# EAGLE design CONTROL (EAGLE 6.4)
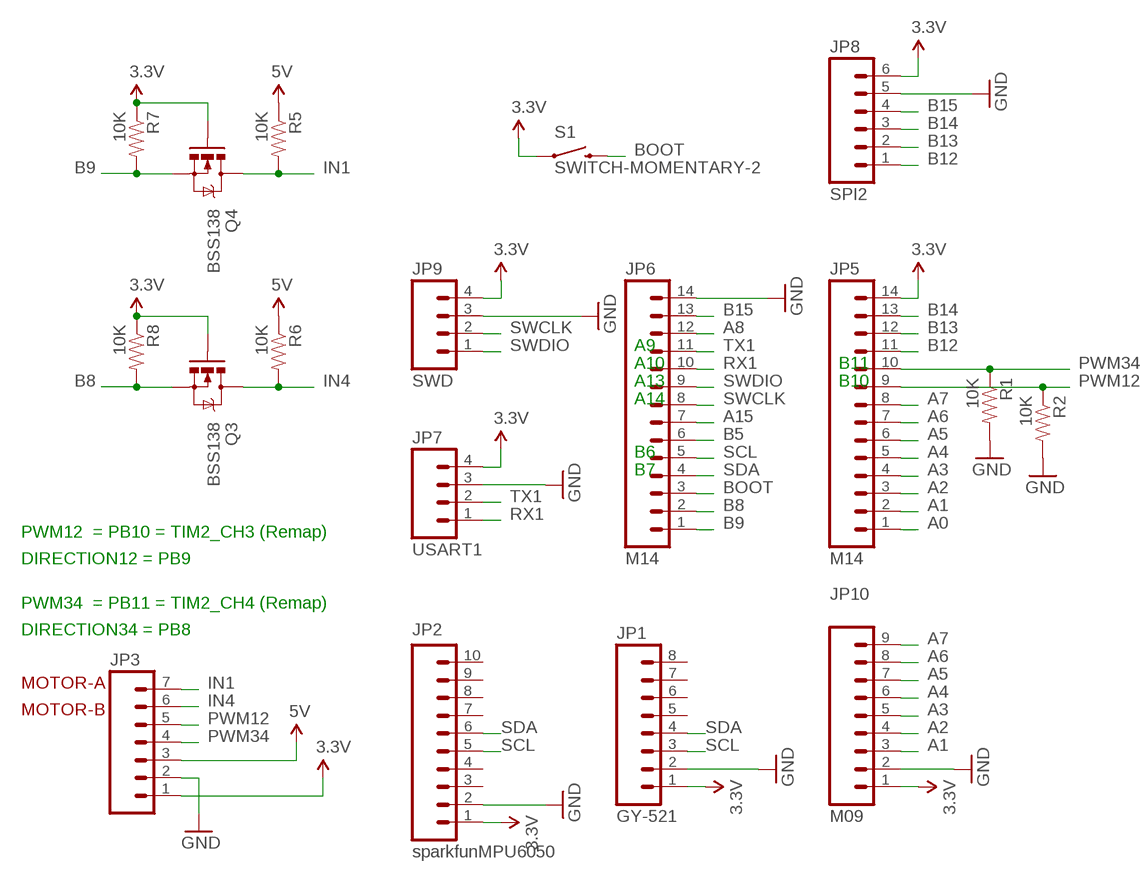
[diagram p0: schematic, sheet 1]

## Parts
JP1  GY-521  M081X08  [1X08]
JP2  sparkfunMPU6050  M10"  [1X10]
JP3  M07LONGPADS  [1X07_LONGPADS]
JP5  M14  [1X14]
JP6  M14  [1X14]
JP7  USART1  M04PTH  [1X04]
JP8  SPI2  M06SIP  [1X06]
JP9  SWD  M04PTH  [1X04]
JP10  M09  [1X09]
Q3  BSS138  MOSFET-NCHANNELSMD  [SOT23-3]
Q4  BSS138  MOSFET-NCHANNELSMD  [SOT23-3]
R1  10K  RESISTOR0805-RES  [0805]
R2  10K  RESISTOR0805-RES  [0805]
R5  10K  RESISTOR0805-RES  [0805]
R6  10K  RESISTOR0805-RES  [0805]
R7  10K  RESISTOR0805-RES  [0805]
R8  10K  RESISTOR0805-RES  [0805]
S1  SWITCH-MOMENTARY-2  [TACTILE_SWITCH_TALL]

## Nets
3.3V: JP1.1 JP2.1 JP3.1 JP5.14 JP7.4 JP8.6 JP9.4 JP10.1 Q3.1(G) Q4.1(G) R7.1 R8.1 S1.A2
5V: JP3.3 R5.1 R6.1
A0: JP5.1
A1: JP5.2 JP10.3
A2: JP5.3 JP10.4
A3: JP5.4 JP10.5
A4: JP5.5 JP10.6
A5: JP5.6 JP10.7
A6: JP5.7 JP10.8
A7: JP5.8 JP10.9
A8: JP6.12
A15: JP6.7
B5: JP6.6
B8: JP6.2 Q3.2(S) R8.2
B9: JP6.1 Q4.2(S) R7.2
B12: JP5.11 JP8.1
B13: JP5.12 JP8.2
B14: JP5.13 JP8.3
B15: JP6.13 JP8.4
BOOT: JP6.3 S1.B2
GND: JP1.2 JP2.2 JP3.2 JP6.14 JP7.3 JP8.5 JP9.3 JP10.2 R1.2 R2.2
IN1: JP3.7 Q4.3(D) R5.2
IN4: JP3.6 Q3.3(D) R6.2
PWM12: JP3.5 JP5.9 R2.1
PWM34: JP3.4 JP5.10 R1.1
RX1: JP6.10 JP7.1
SCL: JP1.3 JP2.5 JP6.5
SDA: JP1.4 JP2.6 JP6.4
SWCLK: JP6.8 JP9.2
SWDIO: JP6.9 JP9.1
TX1: JP6.11 JP7.2
Unconnected: JP1.5 JP1.6 JP1.7 JP1.8 JP2.3 JP2.4 JP2.7 JP2.8 JP2.9 JP2.10

## Notes on the sheet
- A9
- A10 | B11
- A13 | B10
- A14
- B6
- B7
- PWM12  = PB10 = TIM2_CH3 (Remap)
- DIRECTION12 = PB9
- PWM34  = PB11 = TIM2_CH4 (Remap)
- DIRECTION34 = PB8
- MOTOR-A
- MOTOR-B

## Library data of the parts
JP1 = SparkFun-Connectors:M08: Header 8 Standard 8-pin 0.1" header. Use with straight break away headers (SKU : PRT-00116), right angle break away headers (PRT-00553), swiss pins (PRT-00743), machine pins (PRT-00117), and female headers (PRT-00115).
JP2 = SparkFun-Connectors:M10: Header 10 Standard 10-pin 0.1" header. Use with straight break away headers (SKU : PRT-00116), right angle break away headers (PRT-00553), swiss pins (PRT-00743), machine pins (PRT-00117), and female headers (PRT-00115).
JP3 = SparkFun-Connectors:M07: Header 7 Standard 7-pin 0.1" header. Use with straight break away headers (SKU : PRT-00116), right angle break away headers (PRT-00553), swiss pins (PRT-00743), machine pins (PRT-00117), and female headers (PRT-00115). NOTES ON THE VARIANTS LOCK and LOCK_LONGPADS... This footprint was designed to help hold the alignment of a through-hole component (i.e. 7-pin header) while soldering it into place. You may notice that each hole has been shifted either up or down by 0.005 of an inch from it's more standard position (which is usually a perfectly straight line). This slight alteration caused the pins (the squares in the middle) to touch the edges of the holes. Because they are alternating, it causes a "brace" to hold the header in place. 0.005 has proven to be the perfect amount of "off-center" position when using our standard breakaway headers. Although looks a little odd when you look at the bare footprint, once you have a header in there, the alteration is very hard to notice. Also, if you push a header all the way into place, it is covered up entirely on the bottom side. This idea of altering the position of holes to aid alignment will be further integrated into the Sparkfun Library for other footprints. It can help hold any component with 3 or more connection pins.
JP5 JP6 = SparkFun-Connectors:M14: Header 14 Standard 14-pin 0.1" header. Use with straight break away headers (SKU : PRT-00116), right angle break away headers (PRT-00553), swiss pins (PRT-00743), machine pins (PRT-00117), and female headers (PRT-00115).
JP7 JP9 = SparkFun-Connectors:M04: Header 4 Standard 4-pin 0.1" header. Use with straight break away headers (SKU : PRT-00116), right angle break away headers (PRT-00553), swiss pins (PRT-00743), machine pins (PRT-00117), and female headers (PRT-00115). Molex polarized connector foot print use with SKU : PRT-08231 with associated crimp pins and housings. 1MM SMD Version SKU: PRT-10208
JP8 = SparkFun-Connectors:M06: Header 6 Standard 6-pin 0.1" header. Use with straight break away headers (SKU : PRT-00116), right angle break away headers (PRT-00553), swiss pins (PRT-00743), machine pins (PRT-00117), and female headers (PRT-00115). Molex polarized connector foot print use with SKU : PRT-08094 with associated crimp pins and housings. NOTES ON THE VARIANTS LOCK and LOCK_LONGPADS... This footprint was designed to help hold the alignment of a through-hole component (i.e. 6-pin header) while soldering it into place. You may notice that each hole has been shifted either up or down by 0.005 of an inch from it's more standard position (which is a perfectly straight line). This slight alteration caused the pins (the squares in the middle) to touch the edges of the holes. Because they are alternating, it causes a "brace" to hold the component in place. 0.005 has proven to be the perfect amount of "off-center" position when using our standard breakaway headers. Although looks a little odd when you look at the bare footprint, once you have a header in there, the alteration is very hard to notice. Also, if you push a header all the way into place, it is covered up entirely on the bottom side. This idea of altering the position of holes to aid alignment will be further integrated into the Sparkfun Library for other footprints. It can help hold any component with 3 or more connection pins.
JP10 = SparkFun-Connectors:M09: Header 9 Standard 9-pin 0.1" header. Use with straight break away headers (SKU : PRT-00116), right angle break away headers (PRT-00553), swiss pins (PRT-00743), machine pins (PRT-00117), and female headers (PRT-00115).
Q3 Q4 = SparkFun-DiscreteSemi:MOSFET-NCHANNEL: Generic NMOS footprint
R1 R2 R5-R8 = SparkFun-Passives:RESISTOR: Resistor Basic schematic elements and footprints for 0603, 1206, and PTH resistors.
S1 = SparkFun-Electromechanical:SWITCH-MOMENTARY-2: Various NO switches- pushbuttons, reed, etc

## Board
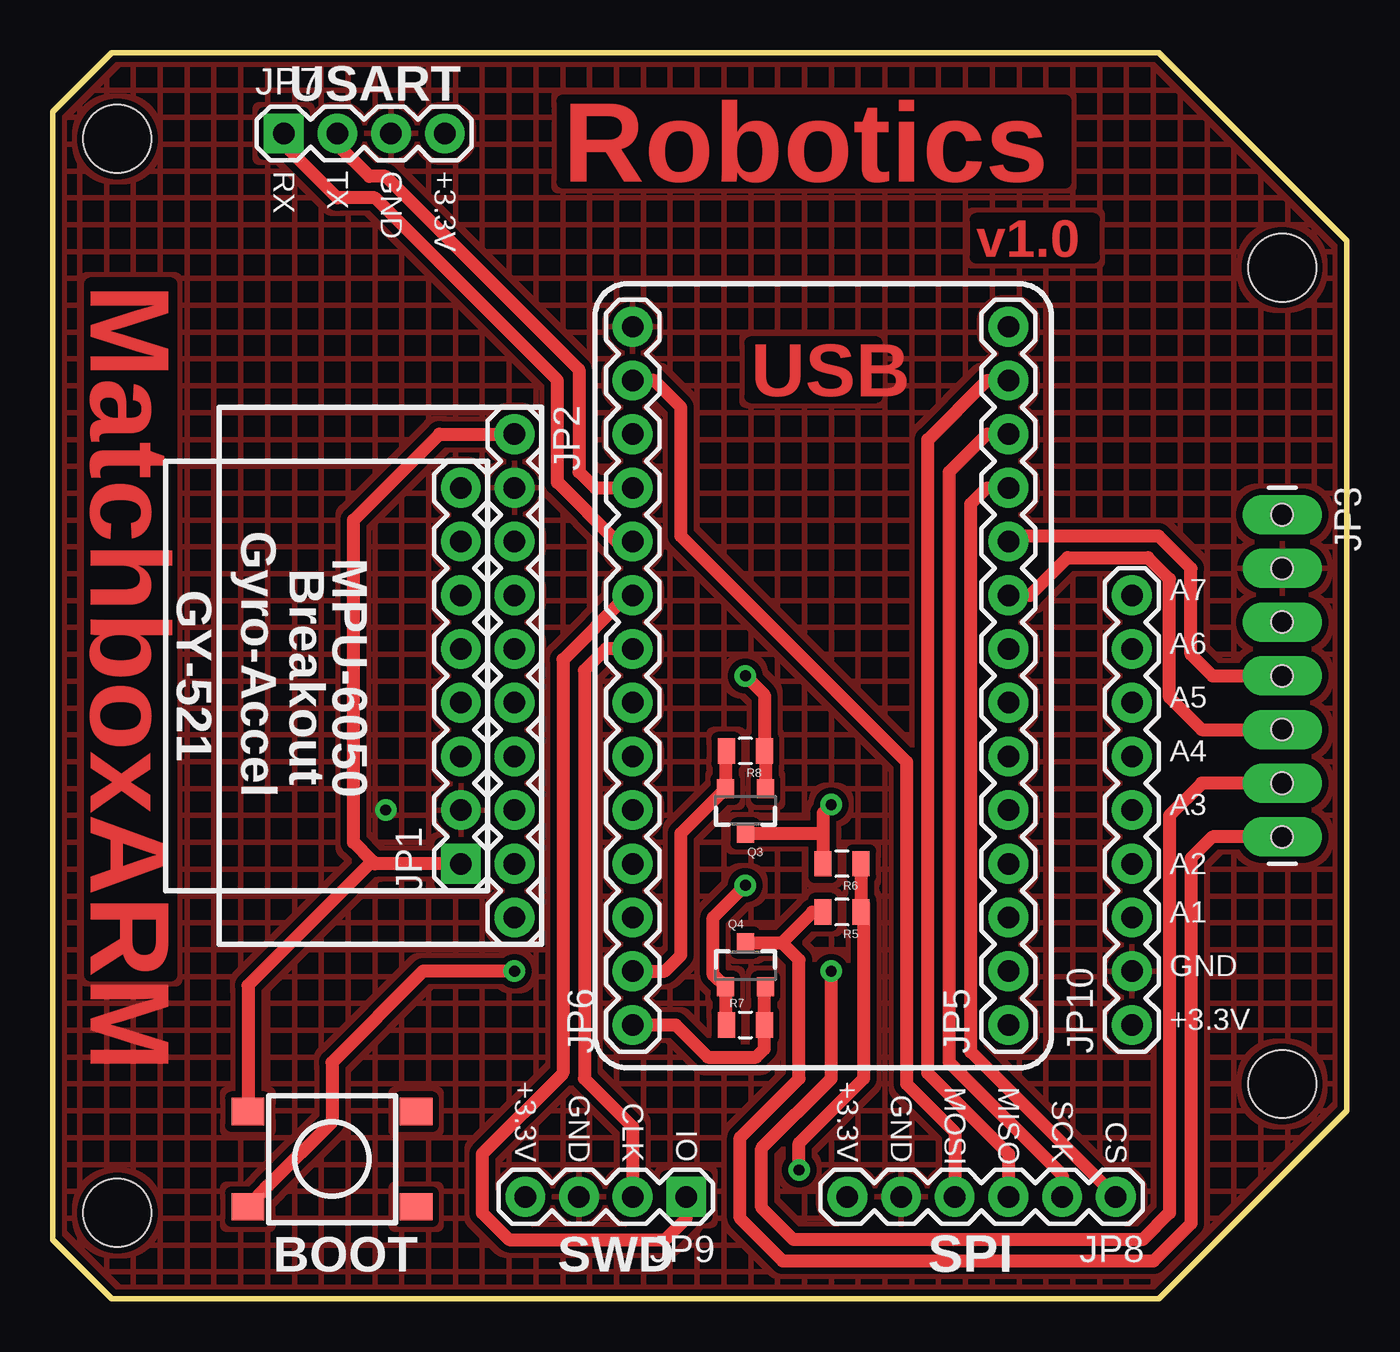
[diagram p1: board, top side]
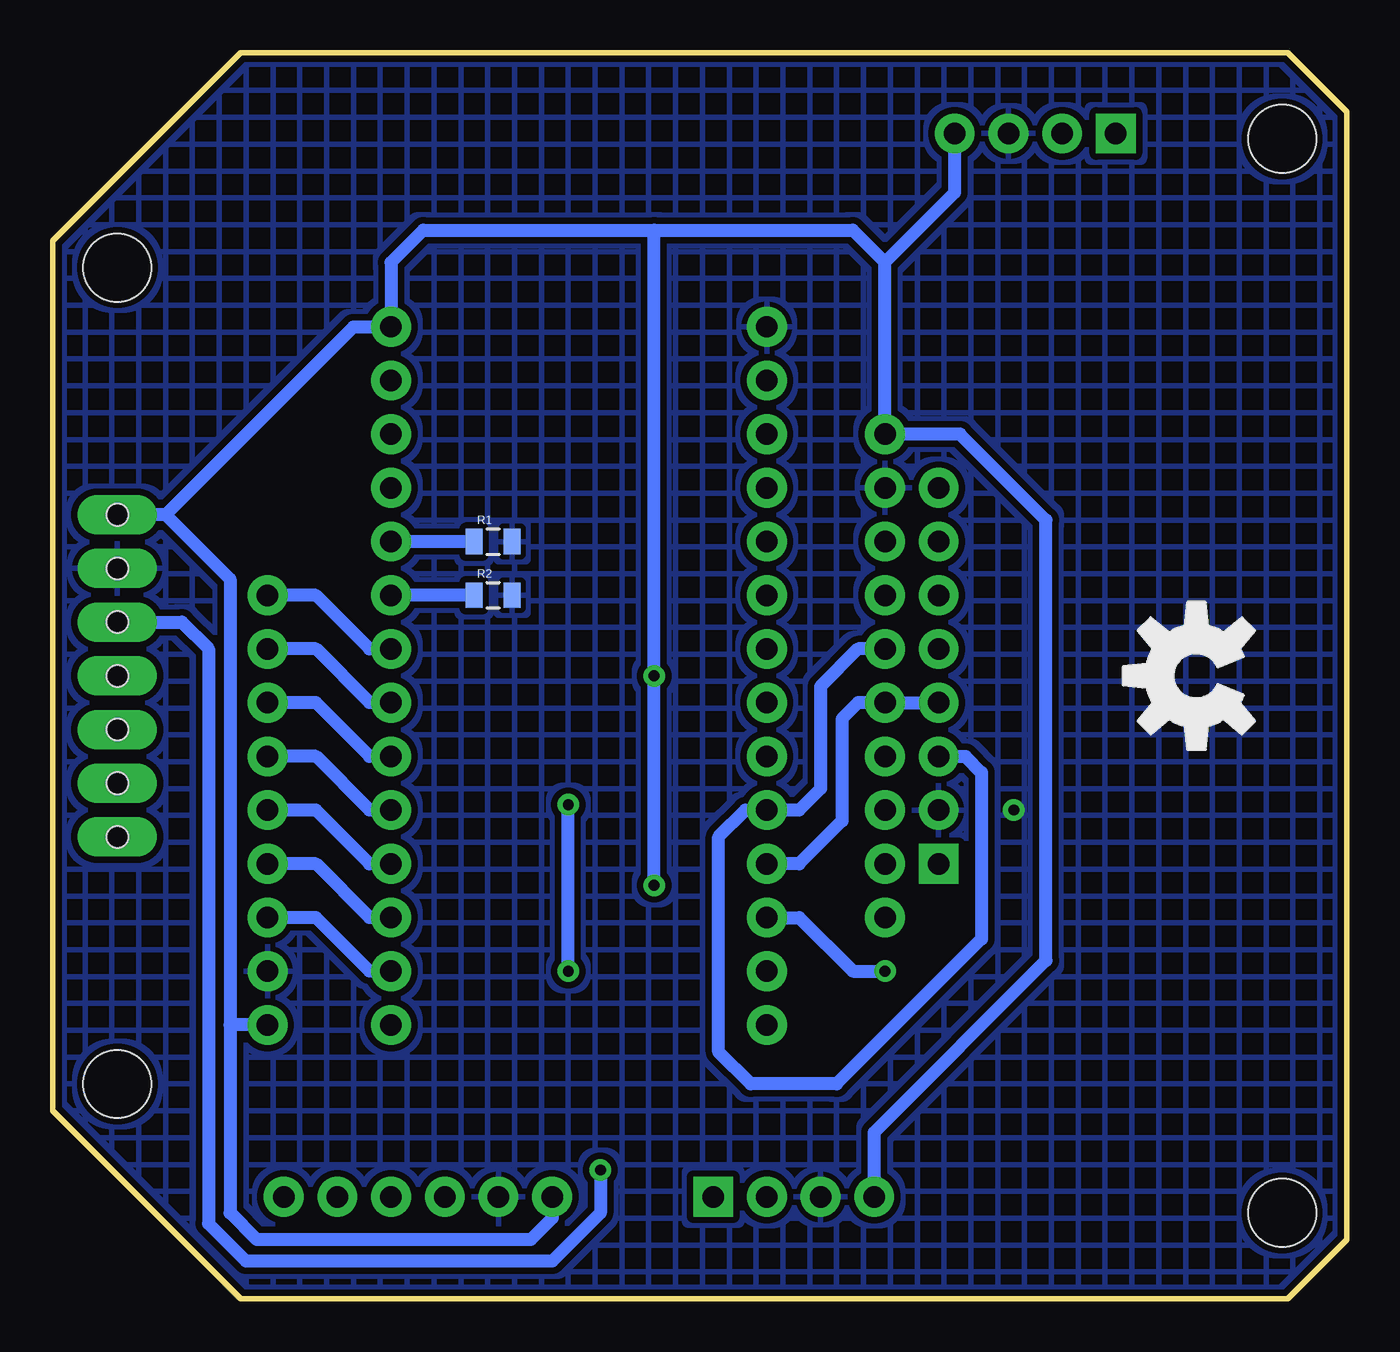
[diagram p2: board, bottom side, seen from below]

Size 61.21 x 58.93 mm. Coordinates in mm from the lower left corner, seen from the top.
Outline: 52.32,58.93 2.79,58.93 0,56.13 0,2.79 2.79,0 52.32,0 61.21,8.89 61.21,50.04 52.32,58.93
Copper layers (1*16): Top 0.035mm / dielectric 1.5mm / Bottom 0.035mm
Design rules "default *": minimum track width 8mil, minimum drill 20mil, track to track 10mil, track to pad 8mil, pad to pad 8mil, via to via 8mil, smd to smd 8mil, copper to edge 10mil, drill to drill 8mil, minimum pad ring 12mil, minimum via ring 10mil, stop-mask expansion 4mil, vias tented up to drill 25mil, thermal gap 10mil
Holes 3.2 mm at 3.05,54.86 58.17,10.16 58.17,48.77 3.05,4.06

### Footprints (pad centres in the part's own frame; a part is rotated, then mirrored left to right if it is on the bottom)
1X08 = drill 1.016 pad 1.88 square: 1 0,0 | drill 1.016 pad 1.88: 2 2.54,0; 3 5.08,0; 4 7.62,0; 5 10.16,0; 6 12.7,0; 7 15.24,0; 8 17.78,0
1X10 = drill 1.016 pad 1.88: 1 0,0; 2 2.54,0; 3 5.08,0; 4 7.62,0; 5 10.16,0; 6 12.7,0; 7 15.24,0; 8 17.78,0; 9 20.32,0; 10 22.86,0
1X07_LONGPADS = drill 1.016 pad 1.88 long: 1 0,0; 2 2.54,0; 3 5.08,0; 4 7.62,0; 5 10.16,0; 6 12.7,0; 7 15.24,0 | hole 1.016: 0,0; 2.54,0; 5.08,0; 7.62,0; 10.16,0; 12.7,0; 15.24,0
1X14 = drill 1.016 pad 1.88: 1 0,0; 2 2.54,0; 3 5.08,0; 4 7.62,0; 5 10.16,0; 6 12.7,0; 7 15.24,0; 8 17.78,0; 9 20.32,0; 10 22.86,0; 11 25.4,0; 12 27.94,0; 13 30.48,0; 14 33.02,0
1X04 = drill 1.016 pad 1.88 square: 1 0,0 | drill 1.016 pad 1.88: 2 2.54,0; 3 5.08,0; 4 7.62,0
1X06 = drill 1.016 pad 1.88: 1 0,0; 2 2.54,0; 3 5.08,0; 4 7.62,0; 5 10.16,0; 6 12.7,0
1X09 = drill 1.016 pad 1.88: 1 0,0; 2 2.54,0; 3 5.08,0; 4 7.62,0; 5 10.16,0; 6 12.7,0; 7 15.24,0; 8 17.78,0; 9 20.32,0
SOT23-3 = smd 0.8 x 0.9: 1 -0.95,-1; 2 0.95,-1; 3 0,1.1
0805 = smd 0.8 x 1.2: 1 -0.9,0; 2 0.9,0
TACTILE_SWITCH_TALL = smd 1.55 x 1.3: A1 -3.975,-2.25; A2 3.975,-2.25; B1 -3.975,2.25; B2 3.975,2.25

### Placement (x,y rotation side)
JP1  19.3,20.57 90 top
JP2  21.84,40.89 270 top
JP3  58.17,37.08 270 top
JP5  45.21,12.95 90 top
JP6  27.43,12.95 90 top
JP7  10.92,55.12 0 top
JP8  50.29,4.83 180 top
JP9  29.97,4.83 180 top
JP10  51.05,12.95 90 top
Q3  32.77,23.11 180 top
Q4  32.77,15.75 0 top
R1  40.39,35.81 0 bottom
R2  40.39,33.27 0 bottom
R5  37.34,18.29 180 top
R6  37.34,20.57 180 top
R7  32.77,12.95 0 top
R8  32.77,25.91 180 top
S1  13.21,6.6 180 top
U$1  [OSHW-LOGO-L]  7.11,29.46 90 bottom
U$2  [CREATIVE_COMMONS]  9.91,-12.19 0 top  (outside the outline)

### Tracks (layer width: path | path; a pad name or v marks a point on that pad's centre or on a via)
3.3V  (via drill 0.51)
  Top 0.61: JP1.1 15.24,20.57 15.11,20.7 | 15.11,20.7 14.22,21.59 14.22,36.83 18.29,40.89 JP2.1 | 15.11,20.7 9.23,14.82 S1.A2 | Q3.1 33.72,25.86 R8.1 33.67,28.56 v32.77,29.46 | R7.1 31.82,13 Q4.1 31.24,15.32 31.24,18.03 v32.77,19.56
  Bottom 0.61: 21.84,49.02 JP2.1 18.29,40.89 14.22,36.83 14.22,16 22.35,7.87 JP9.4 | 52.83,12.95 52.83,34.04 55.88,37.08 | 52.83,12.95 52.83,4.06 51.56,2.79 38.61,2.79 37.59,3.81 JP8.6 | 32.77,50.55 43.69,50.55 45.21,49.02 JP5.14 46.99,45.97 55.88,37.08 | 32.77,50.55 23.37,50.55 21.84,49.02 | 55.88,37.08 JP3.1 | 21.84,49.02 18.54,52.32 JP7.4 | 32.77,50.55 v32.77,29.46 v32.77,19.56 | JP10.1 52.83,12.95
5V  (via drill 0.51)
  Top 0.61: R6.1 R5.1 38.35,18.68 38.35,10.41 35.31,7.37 v35.31,6.1
  Bottom 0.61: v35.31,6.1 35.31,4.06 37.59,1.78 52.07,1.78 53.85,3.56 53.85,30.73 55.12,32 JP3.3
A1
  Bottom 0.61: JP5.2 46.23,15.49 48.77,18.03 JP10.3
A2
  Bottom 0.61: JP5.3 46.23,18.03 48.77,20.57 JP10.4
A3
  Bottom 0.61: JP5.4 46.23,20.57 48.77,23.11 JP10.5
A4
  Bottom 0.61: JP5.5 46.23,23.11 48.77,25.65 JP10.6
A5
  Bottom 0.61: JP5.6 46.23,25.65 48.77,28.19 JP10.7
A6
  Bottom 0.61: JP5.7 46.23,28.19 48.77,30.73 JP10.8
A7
  Bottom 0.61: JP5.8 46.23,30.73 48.77,33.27 JP10.9
B8
  Top 0.61: R8.2 31.82,25.86 Q3.2 29.72,22.02 29.72,16.26 28.96,15.49 JP6.2
B9
  Top 0.61: Q4.2 33.67,14.7 R7.2 33.67,11.82 33.27,11.43 30.99,11.43 29.46,12.95 JP6.1
B12
  Top 0.61: JP8.1 43.43,11.68 43.43,37.59 44.2,38.35 JP5.11
B13
  Top 0.61: JP8.2 47.75,5.84 42.42,11.18 42.42,39.12 44.2,40.89 JP5.12
B14
  Top 0.61: JP8.3 45.21,6.86 41.4,10.67 41.4,40.64 44.2,43.43 JP5.13
B15
  Top 0.61: JP8.4 42.67,7.87 40.39,10.16 40.39,25.4 29.72,36.07 29.72,42.16 28.45,43.43 JP6.13
BOOT  (via drill 0.51)
  Top 0.61: v21.84,15.49 17.53,15.49 13.21,11.18 13.21,8.38 10.2,5.37 S1.B2
  Bottom 0.61: JP6.3 25.91,18.03 23.37,15.49 v21.84,15.49
GND  (via drill 0.51)
  other vias: 15.75,23.11
  pour Bottom (isolate 0.305, hatched): 2.79,58.93 52.32,58.93 61.21,50.04 61.21,8.89 52.32,0 2.79,0 0,2.79 0,56.13
  pour Top (isolate 0.305, hatched): 2.79,58.93 52.32,58.93 61.21,50.04 61.21,8.89 52.32,0 2.79,0 0,2.79 0,56.13
IN1
  Top 0.61: JP3.7 54.86,21.84 53.85,20.83 53.85,3.56 52.07,1.78 34.54,1.78 32.51,3.81 32.51,7.62 35.31,10.41 35.31,16.03 34.49,16.85 | Q4.3 34.49,16.85 | 34.49,16.85 35.93,18.29 R5.2
IN4  (via drill 0.51)
  Top 0.406: 36.44,20.46 R6.2
  Top 0.61: JP3.6 54.36,24.38 52.83,22.86 52.83,4.06 51.56,2.79 35.05,2.79 33.53,4.32 33.53,7.11 36.83,10.41 v36.83,15.49 | Q3.3 36.44,22.01 | v36.83,23.37 36.44,22.98 36.44,22.01 | 36.44,22.01 R6.2
  Bottom 0.61: v36.83,15.49 v36.83,23.37
PWM12
  Top 0.61: JP3.5 54.36,26.92 52.83,28.45 52.83,34.04 51.82,35.05 48.01,35.05 46.23,33.27 JP5.9
  Bottom 0.61: R2.1 JP5.9
PWM34
  Top 0.61: JP3.4 54.86,29.46 53.85,30.48 53.85,34.54 52.32,36.07 45.47,36.07 JP5.10
  Bottom 0.61: R1.1 JP5.10
RX1
  Top 0.61: JP6.10 26.67,35.81 23.88,38.61 23.88,43.43 15.24,52.07 13.46,52.07 10.92,54.61 JP7.1
SCL
  Bottom 0.61: JP2.5 23.11,30.73 24.89,28.96 24.89,24.13 25.91,23.11 JP6.5 28.45,23.11 29.72,21.84 29.72,11.68 28.19,10.16 24.13,10.16 17.27,17.02 17.27,24.89 18.03,25.65 JP1.3
SDA
  Bottom 0.61: JP6.4 25.91,20.57 23.88,22.61 23.88,27.43 23.11,28.19 JP2.6 JP1.4
SWCLK
  Top 0.61: JP6.8 26.16,30.73 25.15,29.72 25.15,10.41 27.43,8.13 JP9.2
SWDIO
  Top 0.61: JP9.1 29.97,3.81 28.96,2.79 21.59,2.79 20.32,4.06 20.32,6.86 24.13,10.67 24.13,30.23 27.18,33.27 JP6.9
TX1
  Top 0.61: JP6.11 25.65,38.35 24.89,39.12 24.89,43.94 15.75,53.09 14.99,53.09 13.46,54.61 JP7.2

### Text on the board
Top: Robotics | v1.0 | MatchboxARM | USB
tPlace: USART | RX | TX | GND | +3.3V | Gyro-Accel | Breakout | MPU-6050 | GY-521 | A7 | A6 | A5 | A4 | A3 | A2 | A1 | GND | +3.3V | +3.3V | GND | +3.3V | GND | MOSI | MISO | CLK | SCK | IO | CS | BOOT | SWD | SPI
tValues: Nedelcu Bogdan Sebastian